# EAGLE schematic MOVEMENT_SCHEMATIC_v22 (EAGLE 9.7.0)
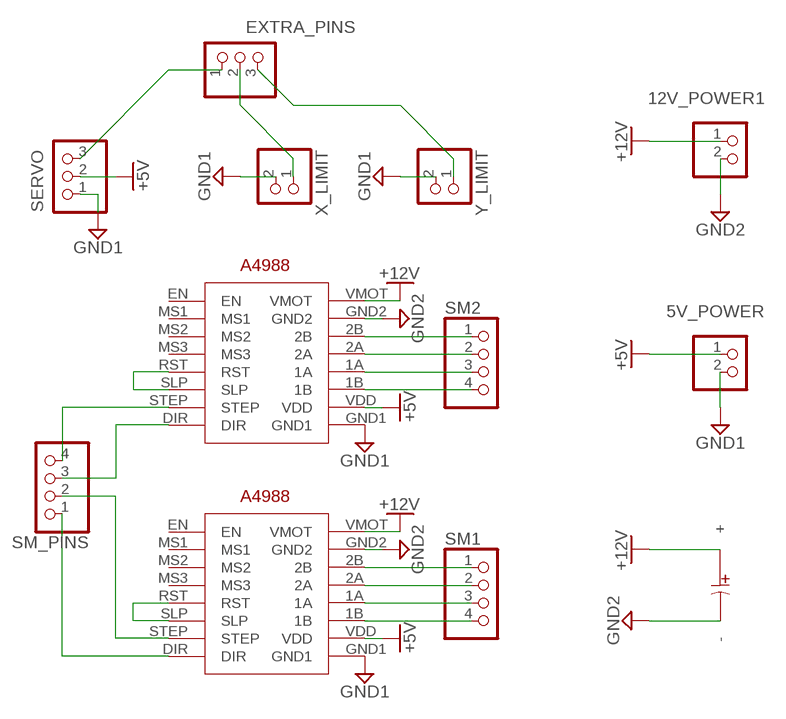
[diagram p0: schematic, sheet 1]

## Parts
5V_POWER  PINHD-1X2  [1X02]
12V_POWER1  PINHD-1X2  [1X02]
EXTRA_PINS  PINHD-1X3  [1X03]
SERVO  PINHD-1X3  [1X03]
SM1  PINHD-1X4  [1X04]
SM2  PINHD-1X4  [1X04]
SM_PINS  PINHD-1X4  [1X04]
U$1  A4988  [A4988]
U$2  100uF  CUSTOM_100UF_CAPACITOR  [CUSTOM_100UF_CAPAACITOR]
U$3  A4988  [A4988]
X_LIMIT  PINHD-1X2  [1X02]
Y_LIMIT  PINHD-1X2  [1X02]

## Nets
+5V: 5V_POWER.1 SERVO.2 U$1.VDD U$3.VDD
+12V: 12V_POWER1.1 U$1.VMOT U$2.1(+) U$3.VMOT
GND1: 5V_POWER.2 SERVO.1 U$1.GND1 U$3.GND1 X_LIMIT.2 Y_LIMIT.2
GND2: 12V_POWER1.2 U$1.GND2 U$2.2(-) U$3.GND2
N$1: SM2.1 U$3.2B
N$2: SM2.2 U$3.2A
N$3: SM2.3 U$3.1A
N$4: SM2.4 U$3.1B
N$5: U$1.RST U$1.SLP
N$6: SM_PINS.4 U$3.STEP
N$7: SM_PINS.3 U$3.DIR
N$8: U$3.RST U$3.SLP
N$9: SM_PINS.1 U$1.DIR
N$10: SM_PINS.2 U$1.STEP
N$11: SM1.1 U$1.2B
N$12: SM1.2 U$1.2A
N$13: SM1.3 U$1.1A
N$14: SM1.4 U$1.1B
N$15: EXTRA_PINS.1 SERVO.3
N$16: EXTRA_PINS.2 X_LIMIT.1
N$17: EXTRA_PINS.3 Y_LIMIT.1
Unconnected: U$1.EN U$1.MS1 U$1.MS2 U$1.MS3 U$3.EN U$3.MS1 U$3.MS2 U$3.MS3

## Library data of the parts
5V_POWER 12V_POWER1 X_LIMIT Y_LIMIT = Connector:PINHD-1X2: PIN HEADER; CATEGORY: Headers; DESCRIPTION: Header, Straight, 2 Position; MANUFACTURER: Generic; MPN: Generic; OPERATING_TEMPERATURE: Generic; PART_STATUS: Active; PITCH: 0.100" (2.54mm); ROHS_COMPLIANCE: Generic; SERIES: Generic; SUB-CATEGORY: Headers, Male Pins; TYPE: Board to Board or Cable, Unshrouded, Through Hole, Straight
EXTRA_PINS SERVO = Connector:PINHD-1X3: PIN HEADER; CATEGORY: Headers; DESCRIPTION: Header, Straight, 3 Position; MANUFACTURER: Generic; MPN: Generic; OPERATING_TEMPERATURE: Generic; PART_STATUS: Active; PITCH: 0.100" (2.54mm); ROHS_COMPLIANCE: Generic; SERIES: Generic; SUB-CATEGORY: Headers, Male Pins; TYPE: Board to Board or Cable, Unshrouded, Through Hole, Straight
SM1 SM2 SM_PINS = Connector:PINHD-1X4: PIN HEADER; CATEGORY: Headers; DESCRIPTION: Header, Straight, 4 Position; MANUFACTURER: Generic; MPN: Generic; OPERATING_TEMPERATURE: Generic; PART_STATUS: Active; PITCH: 0.100" (2.54mm); ROHS_COMPLIANCE: Generic; SERIES: Generic; SUB-CATEGORY: Headers, Male Pins; TYPE: Board to Board or Cable, Unshrouded, Through Hole, Straight
U$1 U$3 = A4988:A4988
U$2 = Custom_100uF_Capacitor:CUSTOM_100UF_CAPACITOR